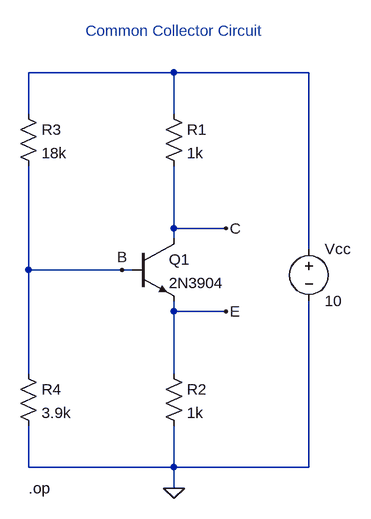
[diagram p0: schematic 2EEB_VELASCO_EXPT7_CKT3.asc]
2EEB_VELASCO_EXPT7_CKT3.asc, the LTspice schematic file:
Version 4
SHEET 1 880 680
WIRE 224 -128 0 -128
WIRE 432 -128 224 -128
WIRE 0 -64 0 -128
WIRE 224 -64 224 -128
WIRE 224 112 224 16
WIRE 304 112 224 112
WIRE 224 128 224 112
WIRE 432 144 432 -128
WIRE 0 176 0 16
WIRE 144 176 0 176
WIRE 160 176 144 176
WIRE 224 240 224 224
WIRE 304 240 224 240
WIRE 0 336 0 176
WIRE 224 336 224 240
WIRE 0 480 0 416
WIRE 224 480 224 416
WIRE 224 480 0 480
WIRE 432 480 432 224
WIRE 432 480 224 480
WIRE 224 512 224 480
FLAG 304 240 E
FLAG 304 112 C
FLAG 144 176 B
FLAG 224 512 0
SYMBOL npn 160 128 R0
SYMATTR InstName Q1
SYMATTR Value 2N3904
SYMBOL res 208 -80 R0
SYMATTR InstName R1
SYMATTR Value 1k
SYMBOL res 208 320 R0
SYMATTR InstName R2
SYMATTR Value 1k
SYMBOL res -16 -80 R0
SYMATTR InstName R3
SYMATTR Value 18k
SYMBOL res -16 320 R0
SYMATTR InstName R4
SYMATTR Value 3.9k
SYMBOL voltage 432 128 R0
WINDOW 123 0 0 Left 0
WINDOW 39 0 0 Left 0
SYMATTR InstName Vcc
SYMATTR Value 10
TEXT 88 -192 Left 2 ;Common Collector Circuit
TEXT 0 512 Left 2 !.op

The netlist it stands for:
* 2EEB_VELASCO_EXPT7_CKT3.asc
Q1 C B E 0 2N3904
R1 N001 C 1k
R2 E 0 1k
R3 N001 B 18k
R4 B 0 3.9k
Vcc N001 0 10
.model NPN NPN
.model PNP PNP
.lib standard.bjt
* Common Collector Circuit
.op
.backanno
.end